# Altium schematic sheet 00-OVERVIEW.SchDoc
size A4
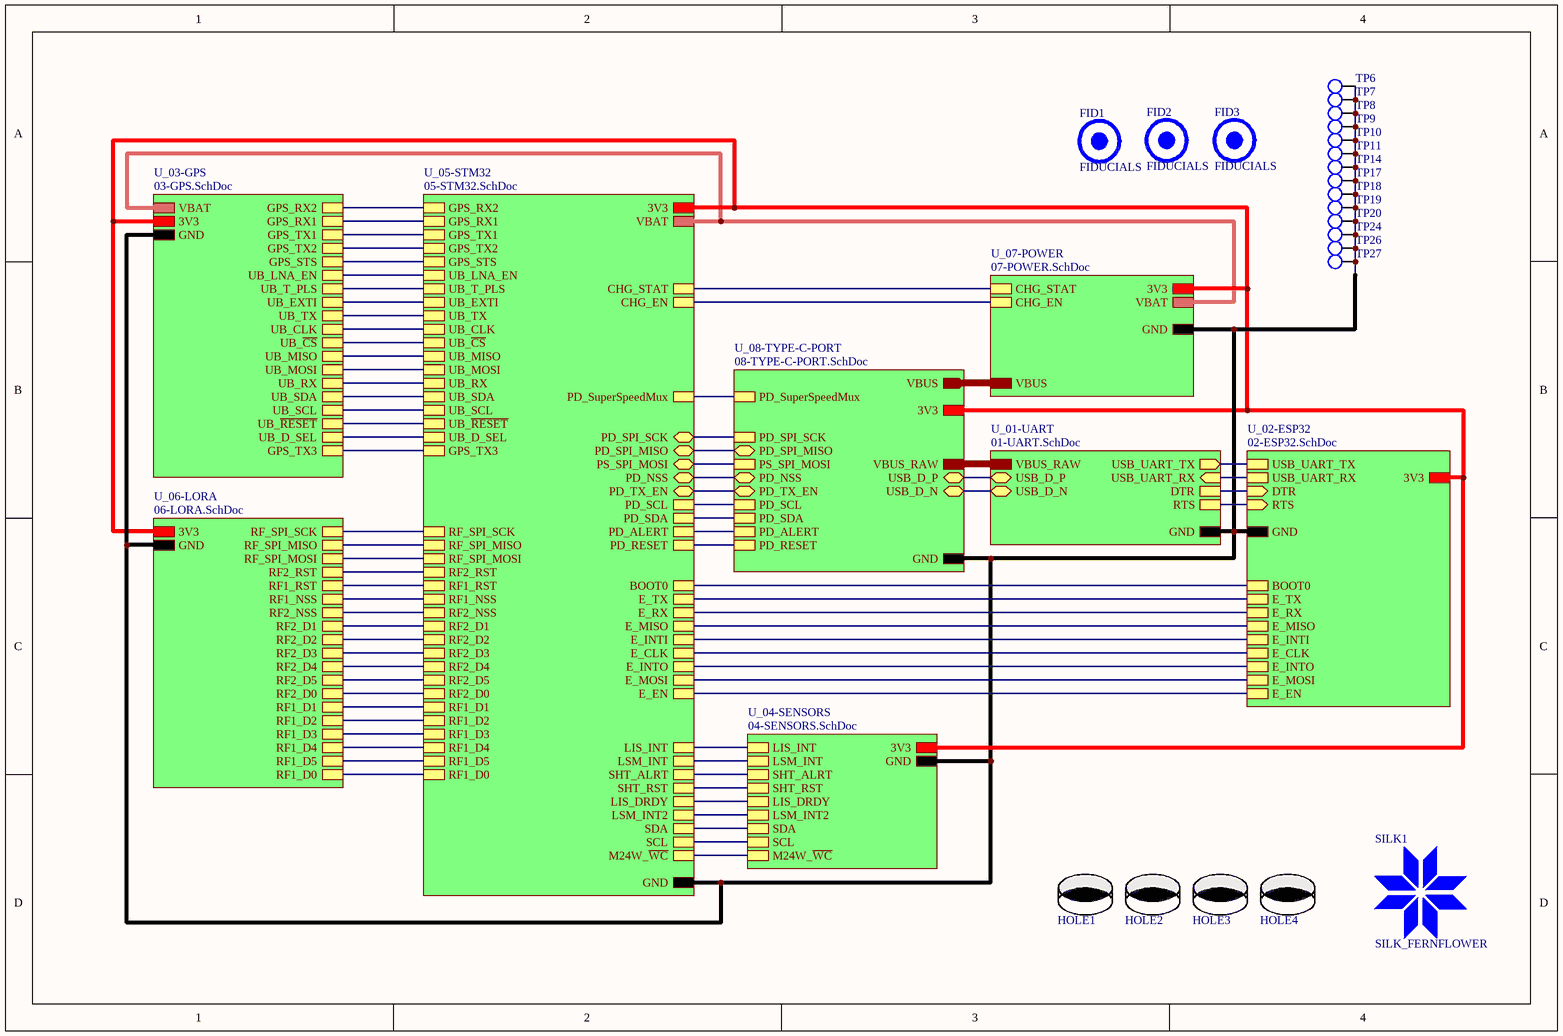
[diagram p0: 00-OVERVIEW.SchDoc]

## Parts
FID1  FIDUCIALS  [FID_C_2-1]  (no BOM)
FID2  FIDUCIALS  [FID_C_5-3-1]  (no BOM)
FID3  FIDUCIALS  [FID_C_2-1]  (no BOM)
HOLE1  HOLE_M3  [HOLE_M3]  (value not drawn)  (no BOM)
HOLE2  HOLE_M3  [HOLE_M3]  (value not drawn)  (no BOM)
HOLE3  HOLE_M3  [HOLE_M3]  (value not drawn)  (no BOM)
HOLE4  HOLE_M3  [HOLE_M3]  (value not drawn)  (no BOM)
SILK1  SILK_FERNFLOWER  [SILK_FERNFLOWER]  (no BOM)
TP6  TEST_POINT  [THOOK_0.8-1]  (value not drawn)  (no BOM)
TP7  TEST_POINT  [THOOK_0.8-1]  (value not drawn)  (no BOM)
TP8  TEST_POINT  [THOOK_0.8-1]  (value not drawn)  (no BOM)
TP9  TEST_POINT  [THOOK_0.8-1]  (value not drawn)  (no BOM)
TP10  TEST_POINT  [THOOK_0.8-1]  (value not drawn)  (no BOM)
TP11  TEST_POINT  [THOOK_0.8-1]  (value not drawn)  (no BOM)
TP14  TEST_POINT  [THOOK_0.8-1]  (value not drawn)  (no BOM)
TP17  TEST_POINT  [THOOK_0.8-1]  (value not drawn)  (no BOM)
TP18  TEST_POINT  [THOOK_0.8-1]  (value not drawn)  (no BOM)
TP19  TEST_POINT  [THOOK_0.8-1]  (value not drawn)  (no BOM)
TP20  TEST_POINT  [THOOK_0.8-1]  (value not drawn)  (no BOM)
TP24  TEST_POINT  [THOOK_0.8-1]  (value not drawn)  (no BOM)
TP26  TEST_POINT  [THOOK_0.8-1]  (value not drawn)  (no BOM)
TP27  TEST_POINT  [THOOK_0.8-1]  (value not drawn)  (no BOM)

## Sub-sheets
U_01-UART = 01-UART.SchDoc: GND, VBUS_RAW, USB_D_P (bidir), USB_UART_TX (out), USB_UART_RX (in), DTR, RTS, USB_D_N (bidir)
U_02-ESP32 = 02-ESP32.SchDoc: USB_UART_RX, GND, 3V3, DTR (in), RTS (in), USB_UART_TX, E_EN, E_MISO, E_INTI, E_CLK, E_INTO, E_MOSI, E_TX, E_RX, BOOT0
U_03-GPS = 03-GPS.SchDoc: GPS_RX2, GPS_RX1, GPS_TX1, GPS_TX2, GPS_STS, UB_LNA_EN, UB_T_PLS, UB_EXTI, UB_TX, UB_CLK, UB_~{CS}, UB_MISO, UB_MOSI, UB_RX, UB_SDA, UB_SCL, UB_~{RESET}, VBAT, 3V3, GND, UB_D_SEL, GPS_TX3
U_04-SENSORS = 04-SENSORS.SchDoc: LIS_INT, LSM_INT, SHT_ALRT, SHT_RST, LIS_DRDY, GND, 3V3, LSM_INT2, SCL, SDA, M24W_~{WC}
U_05-STM32 = 05-STM32.SchDoc: CHG_EN, PD_SuperSpeedMux, PD_TX_EN (bidir), PD_SDA, PD_RESET, GND, PD_NSS (bidir), CHG_STAT, E_MISO, E_INTI, E_CLK, E_INTO, E_MOSI, E_EN, PS_SPI_MOSI (bidir), PD_SPI_SCK (bidir), PD_SPI_MISO (bidir), BOOT0, E_RX, E_TX, PD_ALERT, VBAT, 3V3, PD_SCL, UB_D_SEL, UB_TX, UB_~{CS}, UB_~{RESET}, UB_LNA_EN, GPS_STS, GPS_RX2, GPS_RX1, GPS_TX1, GPS_TX2, GPS_TX3, UB_EXTI, UB_T_PLS, UB_RX, UB_SDA, UB_MISO, UB_MOSI, UB_SCL, UB_CLK, LIS_INT, SHT_ALRT, SHT_RST, LSM_INT, LIS_DRDY, SCL, SDA, LSM_INT2, RF_SPI_MISO, RF_SPI_MOSI, RF2_RST, RF1_RST, RF1_NSS, RF_SPI_SCK, RF1_D3, RF1_D4, RF2_D3, RF1_D5, RF1_D0, RF1_D1, RF2_D0, RF2_D2, RF2_D5, RF1_D2, RF2_D4, RF2_D1, RF2_NSS, M24W_~{WC}
U_06-LORA = 06-LORA.SchDoc: RF_SPI_MISO, RF_SPI_MOSI, RF2_RST, RF1_RST, RF1_NSS, RF2_NSS, RF2_D1, RF2_D2, RF2_D3, RF2_D4, RF2_D5, RF2_D0, RF1_D1, RF1_D2, RF1_D3, RF1_D4, RF1_D5, RF1_D0, RF_SPI_SCK, 3V3, GND
U_07-POWER = 07-POWER.SchDoc: VBAT, GND, 3V3, VBUS, CHG_EN, CHG_STAT
U_08-TYPE-C-PORT = 08-TYPE-C-PORT.SchDoc: PD_SuperSpeedMux, PD_SPI_MISO (bidir), PD_NSS (bidir), PD_TX_EN (bidir), PD_SCL, PD_SDA, PD_ALERT, PD_RESET, GND, 3V3, VBUS_RAW, USB_D_P (bidir), PD_SPI_SCK, USB_D_N (bidir), VBUS (out), PS_SPI_MOSI

## Nets
NetTP6_1: TP6.1 TP7.1 TP8.1 TP9.1 TP10.1 TP11.1 TP14.1 TP17.1 TP18.1 TP19.1 TP20.1 TP24.1 TP26.1 TP27.1 ; sheet U_01-UART/GND, sheet U_02-ESP32/GND, sheet U_05-STM32/GND, sheet U_07-POWER/GND, sheet U_08-TYPE-C-PORT/GND, sheet U_03-GPS/GND, sheet U_04-SENSORS/GND, sheet U_06-LORA/GND
(unnamed): sheet U_01-UART/VBUS_RAW, sheet U_08-TYPE-C-PORT/VBUS_RAW
(unnamed): sheet U_01-UART/USB_D_P, sheet U_08-TYPE-C-PORT/USB_D_P
(unnamed): sheet U_01-UART/USB_UART_TX, sheet U_02-ESP32/USB_UART_TX
(unnamed): sheet U_01-UART/USB_UART_RX, sheet U_02-ESP32/USB_UART_RX
(unnamed): sheet U_01-UART/DTR, sheet U_02-ESP32/DTR
(unnamed): sheet U_01-UART/RTS, sheet U_02-ESP32/RTS
(unnamed): sheet U_01-UART/USB_D_N, sheet U_08-TYPE-C-PORT/USB_D_N
(unnamed): sheet U_02-ESP32/3V3, sheet U_05-STM32/3V3, sheet U_07-POWER/3V3, sheet U_08-TYPE-C-PORT/3V3, sheet U_03-GPS/3V3, sheet U_04-SENSORS/3V3, sheet U_06-LORA/3V3
(unnamed): sheet U_02-ESP32/E_EN, sheet U_05-STM32/E_EN
(unnamed): sheet U_02-ESP32/E_MISO, sheet U_05-STM32/E_MISO
(unnamed): sheet U_02-ESP32/E_INTI, sheet U_05-STM32/E_INTI
(unnamed): sheet U_02-ESP32/E_CLK, sheet U_05-STM32/E_CLK
(unnamed): sheet U_02-ESP32/E_INTO, sheet U_05-STM32/E_INTO
(unnamed): sheet U_02-ESP32/E_MOSI, sheet U_05-STM32/E_MOSI
(unnamed): sheet U_02-ESP32/E_TX, sheet U_05-STM32/E_TX
(unnamed): sheet U_02-ESP32/E_RX, sheet U_05-STM32/E_RX
(unnamed): sheet U_02-ESP32/BOOT0, sheet U_05-STM32/BOOT0
(unnamed): sheet U_05-STM32/CHG_EN, sheet U_07-POWER/CHG_EN
(unnamed): sheet U_05-STM32/PD_SuperSpeedMux, sheet U_08-TYPE-C-PORT/PD_SuperSpeedMux
(unnamed): sheet U_05-STM32/PD_TX_EN, sheet U_08-TYPE-C-PORT/PD_TX_EN
(unnamed): sheet U_05-STM32/PD_SDA, sheet U_08-TYPE-C-PORT/PD_SDA
(unnamed): sheet U_05-STM32/PD_RESET, sheet U_08-TYPE-C-PORT/PD_RESET
(unnamed): sheet U_05-STM32/PD_NSS, sheet U_08-TYPE-C-PORT/PD_NSS
(unnamed): sheet U_05-STM32/CHG_STAT, sheet U_07-POWER/CHG_STAT
(unnamed): sheet U_05-STM32/PS_SPI_MOSI, sheet U_08-TYPE-C-PORT/PS_SPI_MOSI
(unnamed): sheet U_05-STM32/PD_SPI_SCK, sheet U_08-TYPE-C-PORT/PD_SPI_SCK
(unnamed): sheet U_05-STM32/PD_SPI_MISO, sheet U_08-TYPE-C-PORT/PD_SPI_MISO
(unnamed): sheet U_05-STM32/PD_ALERT, sheet U_08-TYPE-C-PORT/PD_ALERT
(unnamed): sheet U_05-STM32/VBAT, sheet U_07-POWER/VBAT, sheet U_03-GPS/VBAT
(unnamed): sheet U_05-STM32/PD_SCL, sheet U_08-TYPE-C-PORT/PD_SCL
(unnamed): sheet U_05-STM32/UB_D_SEL, sheet U_03-GPS/UB_D_SEL
(unnamed): sheet U_05-STM32/UB_TX, sheet U_03-GPS/UB_TX
(unnamed): sheet U_05-STM32/UB_~{CS}, sheet U_03-GPS/UB_~{CS}
(unnamed): sheet U_05-STM32/UB_~{RESET}, sheet U_03-GPS/UB_~{RESET}
(unnamed): sheet U_05-STM32/UB_LNA_EN, sheet U_03-GPS/UB_LNA_EN
(unnamed): sheet U_05-STM32/GPS_STS, sheet U_03-GPS/GPS_STS
(unnamed): sheet U_05-STM32/GPS_RX2, sheet U_03-GPS/GPS_RX2
(unnamed): sheet U_05-STM32/GPS_RX1, sheet U_03-GPS/GPS_RX1
(unnamed): sheet U_05-STM32/GPS_TX1, sheet U_03-GPS/GPS_TX1
(unnamed): sheet U_05-STM32/GPS_TX2, sheet U_03-GPS/GPS_TX2
(unnamed): sheet U_05-STM32/GPS_TX3, sheet U_03-GPS/GPS_TX3
(unnamed): sheet U_05-STM32/UB_EXTI, sheet U_03-GPS/UB_EXTI
(unnamed): sheet U_05-STM32/UB_T_PLS, sheet U_03-GPS/UB_T_PLS
(unnamed): sheet U_05-STM32/UB_RX, sheet U_03-GPS/UB_RX
(unnamed): sheet U_05-STM32/UB_SDA, sheet U_03-GPS/UB_SDA
(unnamed): sheet U_05-STM32/UB_MISO, sheet U_03-GPS/UB_MISO
(unnamed): sheet U_05-STM32/UB_MOSI, sheet U_03-GPS/UB_MOSI
(unnamed): sheet U_05-STM32/UB_SCL, sheet U_03-GPS/UB_SCL
(unnamed): sheet U_05-STM32/UB_CLK, sheet U_03-GPS/UB_CLK
(unnamed): sheet U_05-STM32/LIS_INT, sheet U_04-SENSORS/LIS_INT
(unnamed): sheet U_05-STM32/SHT_ALRT, sheet U_04-SENSORS/SHT_ALRT
(unnamed): sheet U_05-STM32/SHT_RST, sheet U_04-SENSORS/SHT_RST
(unnamed): sheet U_05-STM32/LSM_INT, sheet U_04-SENSORS/LSM_INT
(unnamed): sheet U_05-STM32/LIS_DRDY, sheet U_04-SENSORS/LIS_DRDY
(unnamed): sheet U_05-STM32/SCL, sheet U_04-SENSORS/SCL
(unnamed): sheet U_05-STM32/SDA, sheet U_04-SENSORS/SDA
(unnamed): sheet U_05-STM32/LSM_INT2, sheet U_04-SENSORS/LSM_INT2
(unnamed): sheet U_05-STM32/RF_SPI_MISO, sheet U_06-LORA/RF_SPI_MISO
(unnamed): sheet U_05-STM32/RF_SPI_MOSI, sheet U_06-LORA/RF_SPI_MOSI
(unnamed): sheet U_05-STM32/RF2_RST, sheet U_06-LORA/RF2_RST
(unnamed): sheet U_05-STM32/RF1_RST, sheet U_06-LORA/RF1_RST
(unnamed): sheet U_05-STM32/RF1_NSS, sheet U_06-LORA/RF1_NSS
(unnamed): sheet U_05-STM32/RF_SPI_SCK, sheet U_06-LORA/RF_SPI_SCK
(unnamed): sheet U_05-STM32/RF1_D3, sheet U_06-LORA/RF1_D3
(unnamed): sheet U_05-STM32/RF1_D4, sheet U_06-LORA/RF1_D4
(unnamed): sheet U_05-STM32/RF2_D3, sheet U_06-LORA/RF2_D3
(unnamed): sheet U_05-STM32/RF1_D5, sheet U_06-LORA/RF1_D5
(unnamed): sheet U_05-STM32/RF1_D0, sheet U_06-LORA/RF1_D0
(unnamed): sheet U_05-STM32/RF1_D1, sheet U_06-LORA/RF1_D1
(unnamed): sheet U_05-STM32/RF2_D0, sheet U_06-LORA/RF2_D0
(unnamed): sheet U_05-STM32/RF2_D2, sheet U_06-LORA/RF2_D2
(unnamed): sheet U_05-STM32/RF2_D5, sheet U_06-LORA/RF2_D5
(unnamed): sheet U_05-STM32/RF1_D2, sheet U_06-LORA/RF1_D2
(unnamed): sheet U_05-STM32/RF2_D4, sheet U_06-LORA/RF2_D4
(unnamed): sheet U_05-STM32/RF2_D1, sheet U_06-LORA/RF2_D1
(unnamed): sheet U_05-STM32/RF2_NSS, sheet U_06-LORA/RF2_NSS
(unnamed): sheet U_05-STM32/M24W_~{WC}, sheet U_04-SENSORS/M24W_~{WC}
(unnamed): sheet U_07-POWER/VBUS, sheet U_08-TYPE-C-PORT/VBUS

Not connected (* = marked no-connect by the designer): HOLE1 4; HOLE2 4; HOLE3 4; HOLE4 4